# EAGLE design v1_board (EAGLE 9.1.0)
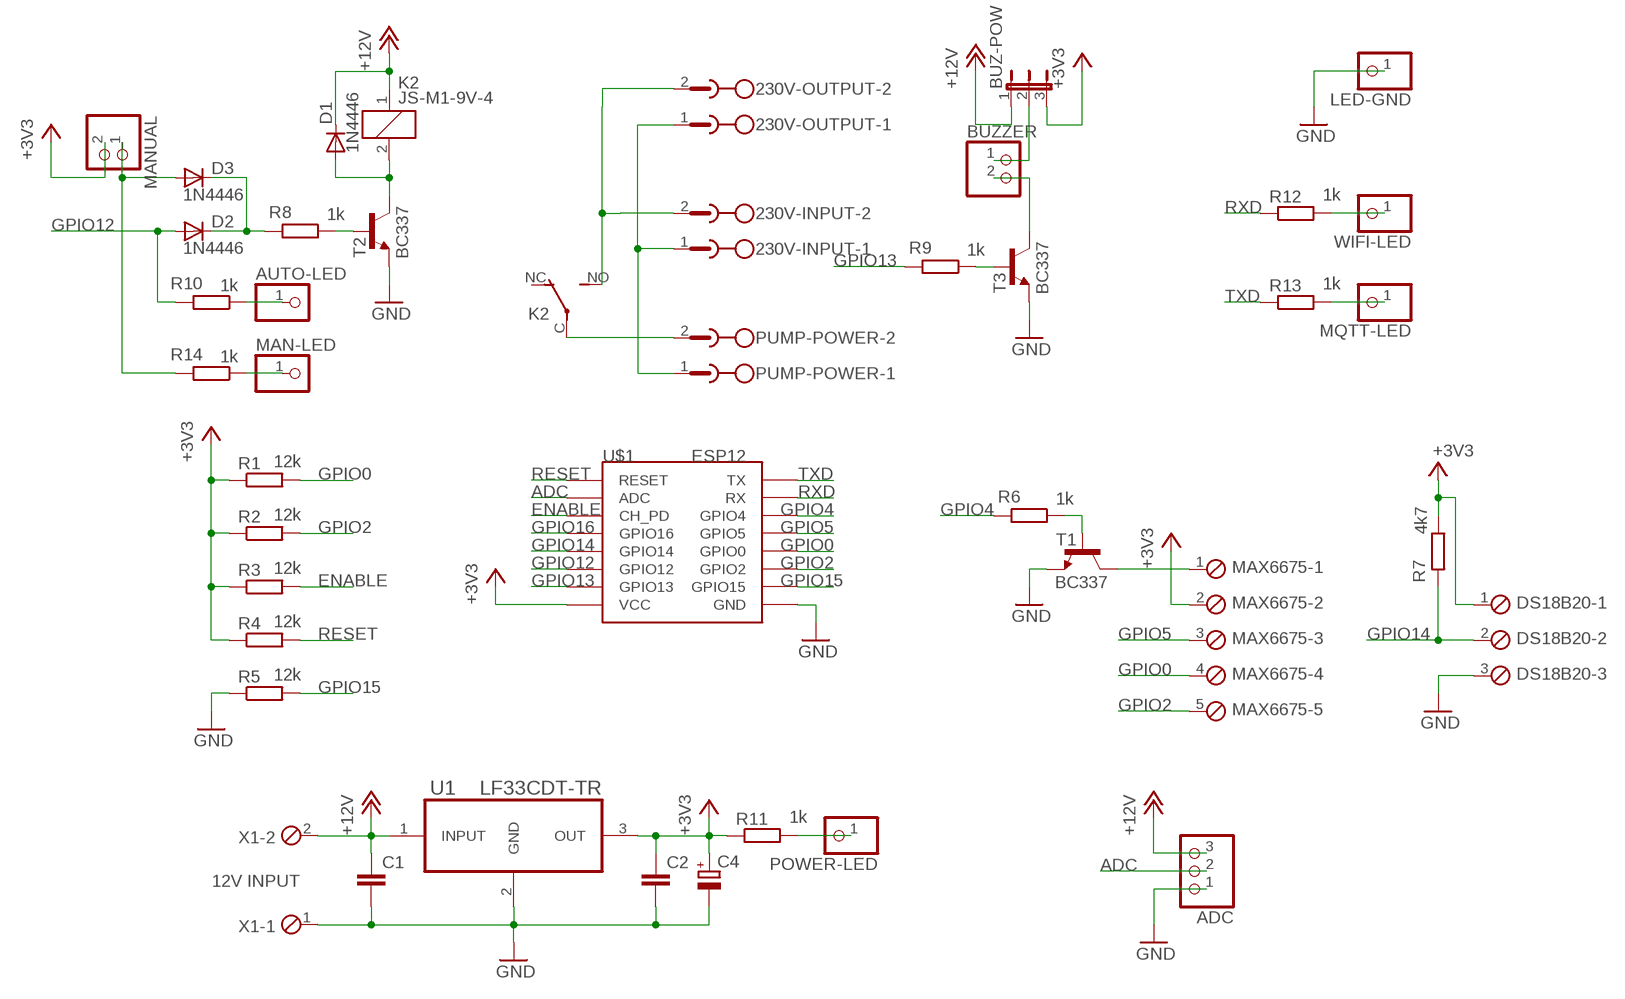
[diagram p0: schematic, sheet 1]

## Parts
230V-INPUT  MSTBV2  [MSTBV2]
230V-OUTPUT  MSTBV2  [MSTBV2]
ADC  PINHD-1X3  [1X03]
AUTO-LED  PINHD-1X1  [1X01]
BUZ-POW  JP2E  [JP2]
BUZZER  PINHD-1X2  [1X02]
C1  C-EU025-025X050  [C025-025X050]
C2  C-EU025-025X050  [C025-025X050]
C4  CPOL-EUE3.5-8  [E3,5-8]
D1  1N4446  [DO35-10]
D2  1N4446  [DO35-10]
D3  1N4446  [DO35-10]
DS18B20  MPT3  [3POL254]
K2  JS-M1-9V-4  [JS-M]
LED-GND  PINHD-1X1  [1X01]
MAN-LED  PINHD-1X1  [1X01]
MANUAL  PINHD-1X2  [1X02]
MAX6675  MPT5  [5POL254]
MQTT-LED  PINHD-1X1  [1X01]
POWER-LED  PINHD-1X1  [1X01]
PUMP-POWER  MSTBV2  [MSTBV2]
R1  12k  R-EU_R1206  [R1206]
R2  12k  R-EU_R1206  [R1206]
R3  12k  R-EU_R1206  [R1206]
R4  12k  R-EU_R1206  [R1206]
R5  12k  R-EU_R1206  [R1206]
R6  1k  R-EU_R1206  [R1206]
R7  4k7  R-EU_R1206  [R1206]
R8  1k  R-EU_R1206  [R1206]
R9  1k  R-EU_R1206  [R1206]
R10  1k  R-EU_R1206  [R1206]
R11  1k  R-EU_R1206  [R1206]
R12  1k  R-EU_R1206  [R1206]
R13  1k  R-EU_R1206  [R1206]
R14  1k  R-EU_R1206  [R1206]
T1  BC337  [TO92]
T2  BC337  [TO92]
T3  BC337  [TO92]
U1  LF33CDT-TR  [TO228P972X240-3N]
U$1  ESP12  [ESP12]
WIFI-LED  PINHD-1X1  [1X01]
X1  12V INPUT  MPT2  [2POL254]

## Nets
+3V3: BUZ-POW.3 C2.1 C4.+ DS18B20.1 MANUAL.2 MAX6675.2 R1.1 R2.1 R3.1 R4.1 R7.1 R11.1 U1.3(OUT) U$1.VCC
+12V: ADC.3 BUZ-POW.1 C1.1 D1.C K2.1 U1.1(INPUT) X1.2
ADC: ADC.2 U$1.ADC
ENABLE: R3.2 U$1.CH_PD
GND: ADC.1 C1.2 C2.2 C4.- DS18B20.3 LED-GND.1 R5.1 T1.1(E) T2.1(E) T3.1(E) U1.2(GND) U$1.GND X1.1
GPIO0: MAX6675.4 R1.2 U$1.GPIO0
GPIO2: MAX6675.5 R2.2 U$1.GPIO2
GPIO4: R6.2 U$1.GPIO4
GPIO5: MAX6675.3 U$1.GPIO5
GPIO12: D2.A R10.2 U$1.GPIO12
GPIO13: R9.2 U$1.GPIO13
GPIO14: DS18B20.2 R7.2 U$1.GPIO14
GPIO15: R5.2 U$1.GPIO15
GPIO16: U$1.GPIO16
N$1: MAX6675.1 T1.3(C)
N$2: R6.1 T1.2(B)
N$3: 230V-INPUT.1 230V-OUTPUT.1 PUMP-POWER.1
N$4: D1.A K2.2 T2.3(C)
N$5: D3.A MANUAL.1 R14.2
N$6: R8.1 T2.2(B)
N$7: BUZZER.2 T3.3(C)
N$8: R9.1 T3.2(B)
N$9: BUZ-POW.2 BUZZER.1
N$10: K2.C(2:P) PUMP-POWER.2
N$11: POWER-LED.1 R11.2
N$12: R12.2 WIFI-LED.1
N$13: MQTT-LED.1 R13.2
N$14: 230V-INPUT.2 230V-OUTPUT.2 K2.NO(2:S)
N$16: AUTO-LED.1 R10.1
N$17: MAN-LED.1 R14.1
N$99: D2.C D3.C R8.2
RESET: R4.2 U$1.RESET
RXD: R12.1 U$1.RX
TXD: R13.1 U$1.TX
Unconnected: K2.NC(2:O)

## Library data of the parts
230V-INPUT 230V-OUTPUT PUMP-POWER = con-phoenix-508:MSTBV2: PHOENIX; MPN: MSTBV 2,5/2-GF-5.08; OC_FARNELL: 1792792; OC_NEWARK: 69R9845
ADC = pinhead:PINHD-1X3: PIN HEADER
AUTO-LED LED-GND MAN-LED MQTT-LED POWER-LED WIFI-LED = pinhead:PINHD-1X1: PIN HEADER
BUZ-POW = jumper:JP2E: JUMPER
BUZZER MANUAL = pinhead:PINHD-1X2: PIN HEADER
C1 C2 = rcl:C-EU: CAPACITOR, European symbol; SPICEPREFIX: C
C4 = rcl:CPOL-EU: POLARIZED CAPACITOR, European symbol; SPICEPREFIX: C
D1-D3 = diode:1N4446: DIODE high speed (Philips)
DS18B20 = con-phoenix-254:MPT3: PHOENIX CONNECTOR; OC_FARNELL: unknown; OC_NEWARK: unknown
K2 = relay:JS-M1*: Automotive Ultra-Miniature Power Relay NAiS Source: http://www.mew-europe.com/.. en_ds_61211_0000.pdf; OC_FARNELL: unknown; OC_NEWARK: unknown
MAX6675 = con-phoenix-254:MPT5: PHOENIX CONNECTOR; OC_FARNELL: unknown; OC_NEWARK: unknown
R1-R14 = rcl:R-EU_: RESISTOR, European symbol; SPICEPREFIX: R
T1-T3 = transistor:BC337: NPN TRANSISTOR
U1 = LF33CDT-TR:LF33CDT-TR: LDO, 0.45VDO, 1A, 3.3V, 1%, 3TO252; AVAILABILITY: Unavailable; DESCRIPTION: LFXX Series 500 mA 3.3 V Fixed VLDO Voltage Regulator with Inhibit - TO-252; MF: STMicroelectronics; MP: LF33CDT-TR; PACKAGE: TO-252-3 STMicroelectronics; PRICE: None
U$1 = esp826612q:ESP12
X1 = con-phoenix-254:MPT2: PHOENIX CONNECTOR; OC_FARNELL: unknown; OC_NEWARK: unknown

## Board
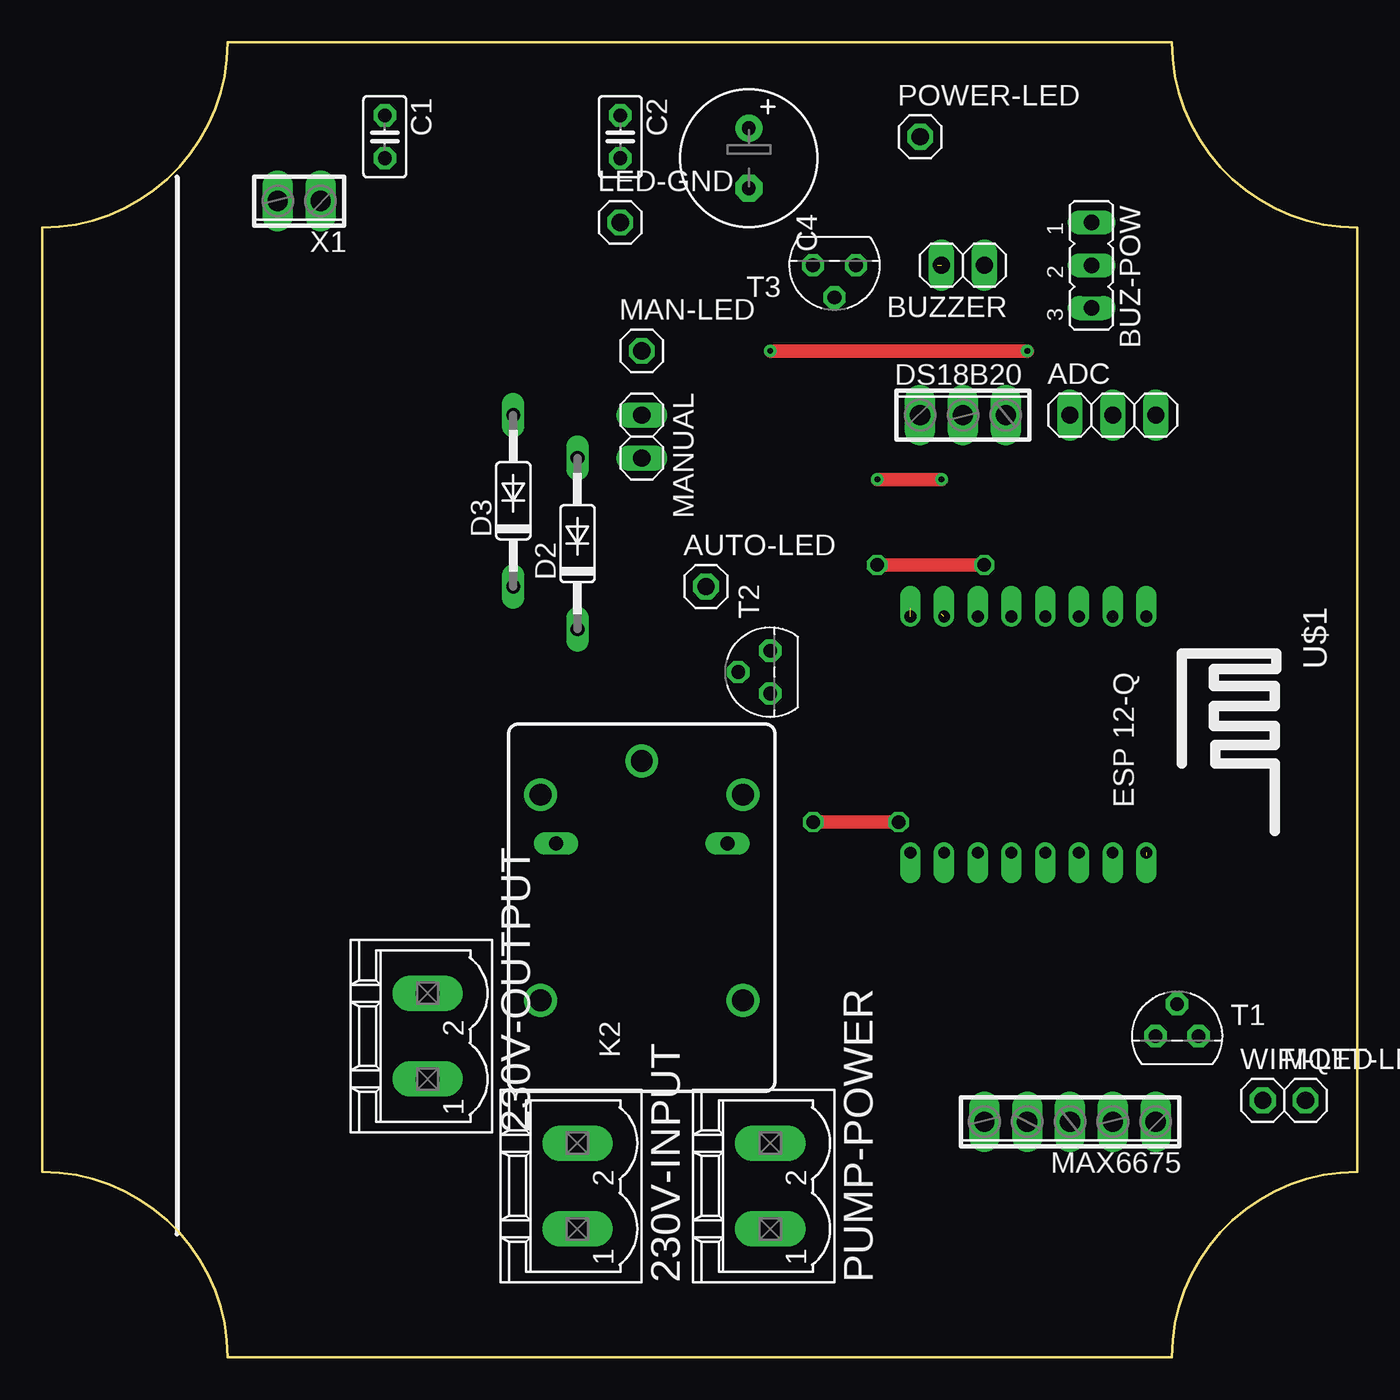
[diagram p1: board, top side]
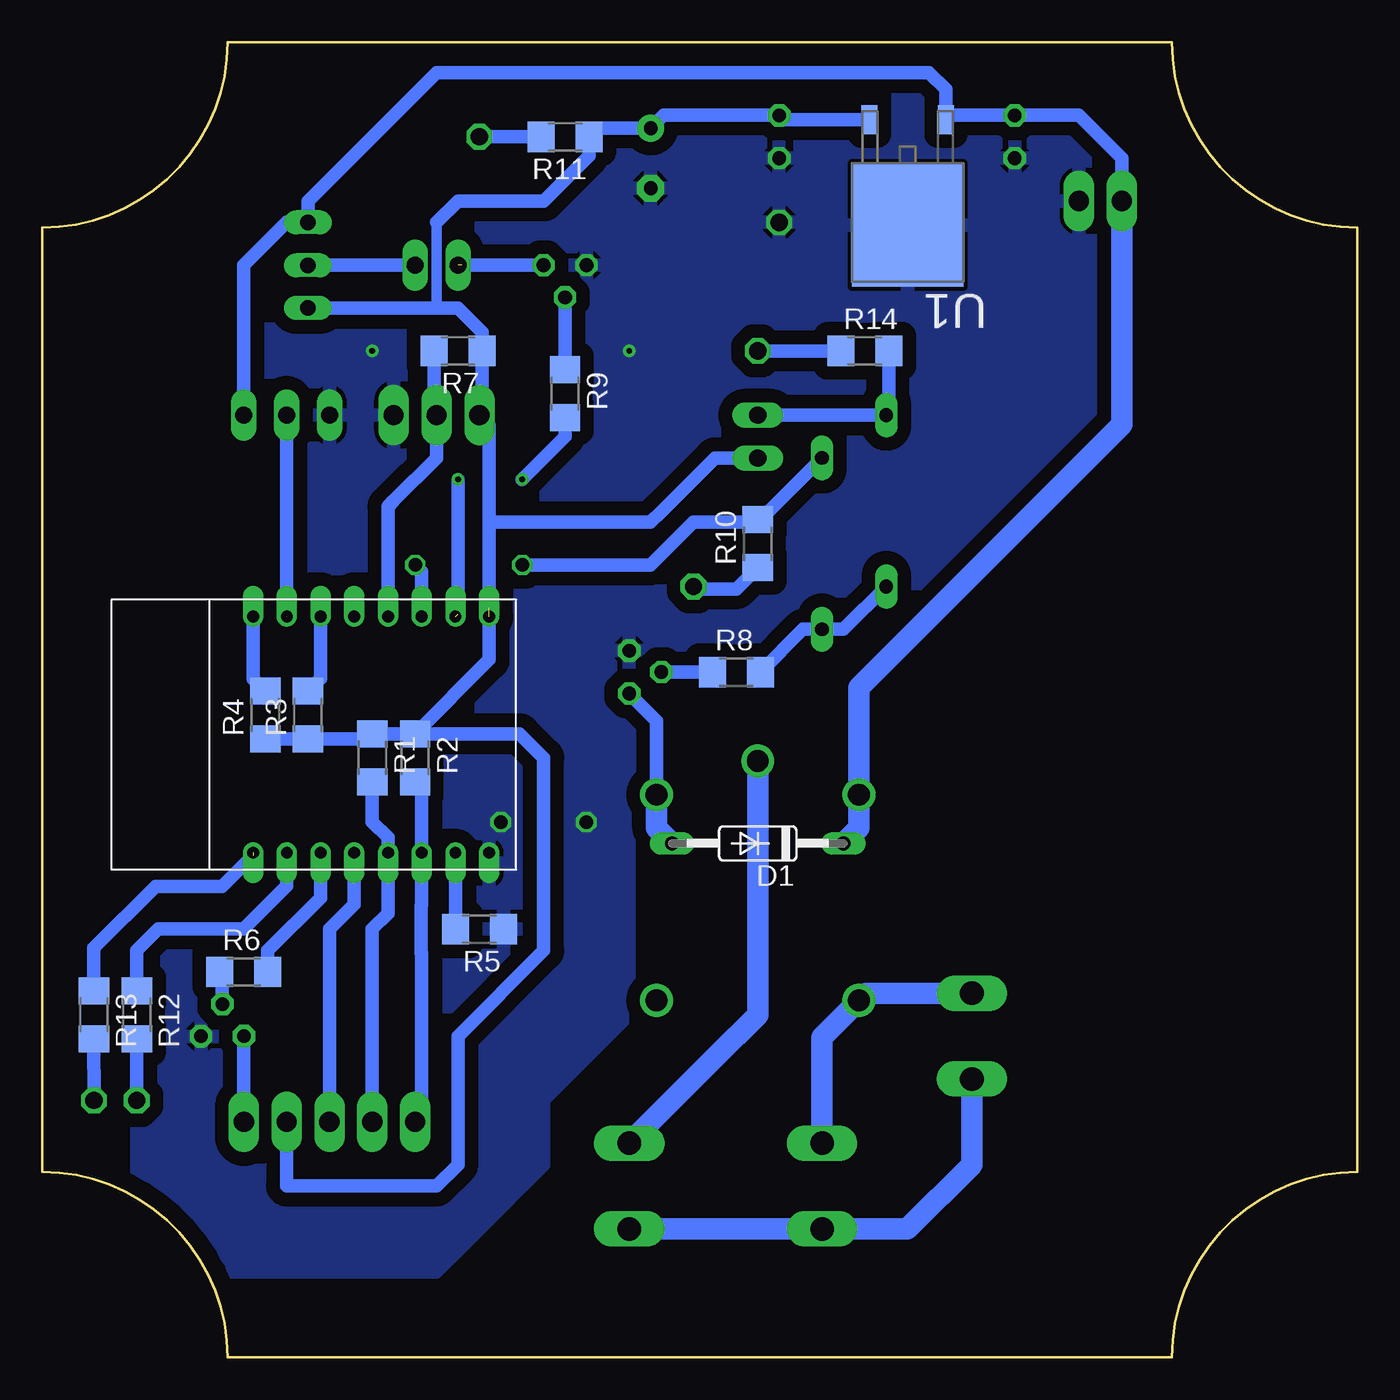
[diagram p2: board, bottom side, seen from below]

Size 78 x 78 mm. Coordinates in mm from the lower left corner, seen from the top.
Outline: 11,0 67,0 arc-90 78,11 78,67 arc-90 67,78 34,78 11,78 arc-90 0,67 0,11 arc-90 11,0
Copper layers (1*16): Top 0.035mm / dielectric 1.5mm / Bottom 0.035mm
Design rules "default *": minimum track width 6mil, minimum drill 0.35mm, track to track 32mil, track to pad 32mil, pad to pad 6mil, via to via 6mil, smd to smd 6mil, copper to edge 40mil, drill to drill 6mil, minimum pad ring 10mil, minimum via ring 8mil, stop-mask expansion 4mil, vias tented up to drill 0mil, thermal gap 10mil

### Footprints (pad centres in the part's own frame; a part is rotated, then mirrored left to right if it is on the bottom)
MSTBV2 = drill 1.397 long: 1 -2.54,0; 2 2.54,0
1X03 = drill 1.016 long: 1 -2.54,0; 2 0,0; 3 2.54,0
1X01 = drill 1.016 octagon: 1 0,0
JP2 = drill 0.914 long: 1 -2.54,0; 2 0,0; 3 2.54,0
1X02 = drill 1.016 long: 1 -1.27,0; 2 1.27,0
C025-025X050 = drill 0.813 octagon: 1 -1.27,0; 2 1.27,0
E3,5-8 = drill 0.813 pad 1.6: + -1.778,0 | drill 0.813 pad 1.6 octagon: - 1.778,0
DO35-10 = drill 0.813 long: A 5.08,0; C -5.08,0
3POL254 = drill 1.2 long: 1 -2.54,0; 2 0,0; 3 2.54,0
JS-M = drill 1.3: 1 6.7,6; 2 6.7,-6; C 8.7,0; NC -5.5,-6; NO -5.5,6
5POL254 = drill 1.2 long: 1 -5.08,0; 2 -2.54,0; 3 0,0; 4 2.54,0; 5 5.08,0
R1206 = smd 1.6 x 1.803: 1 -1.422,0; 2 1.422,0
TO92 = drill 0.813 octagon: 1 1.27,0; 2 0,1.905; 3 -1.27,0
TO228P972X240-3N = smd 0.94 x 1.702: 1 -2.261,-6.096; 3 2.261,-6.096 | smd 6.604 x 7.315: 2 0,0.152
ESP12 = drill 0.7 offset: ADC -7.1,3.8; CH_PD -7.1,1.8; GND 6.9,-8.2; GPIO0 6.9,-2.2; GPIO2 6.9,-4.2; GPIO4 6.9,1.8; GPIO5 6.9,-0.2; GPIO12 -7.1,-4.2; GPIO13 -7.1,-6.2; GPIO14 -7.1,-2.2; GPIO15 6.9,-6.2; GPIO16 -7.1,-0.2; RESET -7.1,5.8; RX 6.9,3.8; TX 6.9,5.8; VCC -7.1,-8.2
2POL254 = drill 1.2 long: 1 -1.27,0; 2 1.27,0

### Placement (x,y rotation side)
230V-INPUT  31.75,10.16 90 top
230V-OUTPUT  22.86,19.05 90 top
ADC  63.5,55.88 0 top
AUTO-LED  39.37,45.72 0 top
BUZ-POW  62.23,64.77 270 top
BUZZER  54.61,64.77 180 top
C1  20.32,72.39 270 top
C2  34.29,72.39 270 top
C4  41.91,71.12 270 top
D1  35.56,30.48 180 bottom
D2  31.75,48.26 90 top
D3  27.94,50.8 90 top
DS18B20  54.61,55.88 0 top
K2  35.56,26.67 90 top
LED-GND  34.29,67.31 0 top
MAN-LED  35.56,59.69 0 top
MANUAL  35.56,54.61 270 top
MAX6675  60.96,13.97 180 top
MQTT-LED  74.93,15.24 0 top
POWER-LED  52.07,72.39 0 top
PUMP-POWER  43.18,10.16 90 top
R1  58.42,35.56 270 bottom
R2  55.88,35.56 270 bottom
R3  62.23,38.1 90 bottom
R4  64.77,38.1 90 bottom
R5  52.07,25.4 180 bottom
R6  66.04,22.86 0 bottom
R7  53.34,59.69 180 bottom
R8  36.83,40.64 0 bottom
R9  46.99,57.15 270 bottom
R10  35.56,48.26 90 bottom
R11  46.99,72.39 180 bottom
R12  72.39,20.32 270 bottom
R13  74.93,20.32 270 bottom
R14  29.21,59.69 0 bottom
T1  67.31,19.05 0 top
T2  43.18,40.64 90 top
T3  46.99,64.77 180 top
U1  26.67,67.31 180 bottom
U$1  59.69,36.83 270 top
WIFI-LED  72.39,15.24 0 top
X1  15.24,68.58 180 top

### Tracks (layer width: path | path; a pad name or v marks a point on that pad's centre or on a via)
+3V3  (1 unrouted)
  Bottom 0.61: 54.61,67.31 54.61,62.23
  Bottom 0.813: U1.3 34.04,73.41 C2.1 41.15,73.66 C4.+ 45.06,72.9 R11.1 45.57,71.27 48.26,68.58 53.34,68.58 54.61,67.31 | R2.1 R1.1 58.72,36.68 R3.1 R4.1 | 51.49,49.53 51.49,55.3 DS18B20.1 51.92,56.03 R7.1 51.92,60.81 53.34,62.23 54.61,62.23 BUZ-POW.3 | 51.49,49.53 51.49,44.45 | MANUAL.2 38.1,53.34 39.37,52.07 41.27,50.16 41.91,49.53 51.49,49.53 | MAX6675.2 63.5,10.16 54.61,10.16 53.34,11.43 53.34,19.05 48.26,24.13 48.26,35.56 49.68,36.98 R2.1 | R2.1 51.49,41.37 U$1.VCC
+12V
  Bottom 0.813: ADC.3 66.04,64.77 63.5,67.31 BUZ-POW.1 62.23,68.58 54.61,76.2 25.4,76.2 24.41,75.21 U1.1 24.16,73.66 C1.1 16.51,73.66 13.97,71.12 X1.2
  Bottom 1.27: X1.2 13.97,55.31 29.56,39.72 K2.1 29.56,31.4 D1.C
ADC  (1 unrouted)
  Bottom 0.813: ADC.2 U$1.ADC
ENABLE
  Bottom 0.813: R3.2 61.49,40.26 U$1.CH_PD
GND  (via drill 0.35, 0.8)
  Top 0.813: v43.18,59.69 v58.42,59.69 | v45.72,31.75 v50.8,31.75
  pour Bottom: 11.43,77.47 67.31,77.47 77.47,67.31 77.47,45.72 67.31,45.72 67.31,29.21 67.31,27.94 72.39,27.94 72.39,6.35 71.12,5.08 54.61,5.08 48.26,11.43 48.26,15.24 43.18,20.32 43.18,33.02 39.37,36.83 36.83,39.37 27.94,39.37 11.43,55.88
GPIO0
  Bottom 0.813: MAX6675.4 58.42,25.4 57.49,26.33 57.49,29.21 | R1.2 58.42,31.75 57.49,30.82 57.49,29.21 | U$1.GPIO0 57.49,29.21
GPIO2
  Bottom 0.813: MAX6675.5 55.49,14.36 55.49,23.97 55.51,23.99 55.51,26.81 55.49,26.83 U$1.GPIO2 55.49,33.75 | 55.49,33.75 R2.2 55.49,33.75
GPIO4
  Bottom 0.813: R6.2 64.62,24.13 61.49,27.26 U$1.GPIO4
GPIO5
  Bottom 0.813: MAX6675.3 60.96,25.4 59.49,26.87 U$1.GPIO5
GPIO12  (via drill 0.35, 0.8)
  Top 0.813: v49.53,46.99 v55.88,46.99
  Bottom 0.813: D2.A 35.41,49.68 R10.2 35.71,49.53 39.37,49.53 41.91,46.99 v49.53,46.99 | v55.88,46.99 55.49,46.6 U$1.GPIO12
GPIO13  (via drill 0.35)  (1 unrouted)
  Top 0.813: v49.53,52.07 v53.34,52.07
  Bottom 0.813: R9.2 46.99,54.61 v49.53,52.07 | v53.34,52.07 53.34,44.08
GPIO14
  Bottom 0.813: 57.15,50.8 54.61,53.34 DS18B20.2 54.76,56.03 R7.2 | 57.15,50.8 57.49,50.46 | 57.15,50.8 57.49,50.46 | 57.49,50.46 U$1.GPIO14
GPIO15
  Bottom 0.813: R5.2 | U$1.GPIO15 R5.2
N$1
  Bottom 0.813: MAX6675.1 T1.3
N$2
  Bottom 0.813: T1.2 67.31,22.71 R6.1
N$3
  Bottom 1.27: 230V-OUTPUT.1 22.86,11.43 26.67,7.62 230V-INPUT.1 PUMP-POWER.1
N$4
  Bottom 0.813: T2.3 41.56,37.75 K2.2
  Bottom 1.27: K2.2 41.56,31.4 D1.A
N$5
  Bottom 0.813: R14.2 27.79,56.03 D3.A MANUAL.1
N$6
  Bottom 0.813: T2.2 R8.1
N$7  (1 unrouted)
  Bottom 0.813: T3.3 52.07,64.77 | 52.07,64.77 53.09,64.77 52.07,64.77
N$8
  Bottom 0.813: R9.1 T3.2
N$9
  Bottom 0.813: BUZ-POW.2 BUZZER.1
N$10
  Bottom 1.27: PUMP-POWER.2 38.1,17.78 35.56,20.32 K2.C
N$11
  Bottom 0.813: R11.2 POWER-LED.1
N$12
  Bottom 0.813: R12.2 WIFI-LED.1
N$13
  Bottom 0.813: R13.2 MQTT-LED.1
N$14
  Bottom 1.27: 230V-OUTPUT.2 29.14,21.59 K2.NO 31.75,18.98 230V-INPUT.2
N$16
  Bottom 0.813: AUTO-LED.1 39.22,45.57 36.83,45.57 R10.1
N$17
  Bottom 0.813: R14.1 MAN-LED.1
N$99
  Bottom 0.813: R8.2 32.87,43.18 D2.C 30.48,43.18 D3.C
RESET
  Bottom 0.813: R4.2 65.49,40.24 U$1.RESET
RXD
  Bottom 0.813: R12.1 72.39,24.13 71.12,25.4 66.04,25.4 63.49,27.95 U$1.RX
TXD  (1 unrouted)
  Bottom 0.813: 65.49,29.76 67.31,27.94 71.27,27.94 74.93,24.28 R13.1